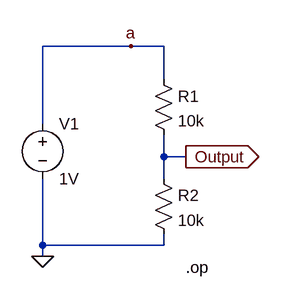
[diagram p0: schematic Voltage_Divider.asc]
Voltage_Divider.asc, the LTspice schematic file:
Version 4.1
SHEET 1 880 680
WIRE 96 16 -32 16
WIRE 144 16 96 16
WIRE 144 64 144 16
WIRE -32 128 -32 16
WIRE 144 176 144 144
WIRE 176 176 144 176
WIRE 144 208 144 176
WIRE -32 304 -32 208
WIRE 144 304 144 288
WIRE 144 304 -32 304
WIRE -32 320 -32 304
FLAG -32 320 0
FLAG 96 16 a
FLAG 176 176 Output
IOPIN 176 176 Out
SYMBOL res 128 48 R0
SYMATTR InstName R1
SYMATTR Value 10k
SYMBOL res 128 192 R0
SYMATTR InstName R2
SYMATTR Value 10k
SYMBOL voltage -32 112 R0
WINDOW 123 0 0 Left 0
WINDOW 39 0 0 Left 0
SYMATTR InstName V1
SYMATTR Value 1V
TEXT 176 336 Left 2 !.op

The netlist it stands for:
* Voltage_Divider.asc
R1 a Output 10k
R2 Output 0 10k
V1 a 0 1V
.op
.backanno
.end

* Results of the author's LTspice run, read from the files saved beside the schematic
* Operating Point:
*   V(output) = 500 mV
*   V(a) = 1 V
*   I(V1) = -50 µA
*   I(R1) = 50 µA
*   I(R2) = 50 µA